# Altium schematic sheet POWER.SchDoc (part 2 of 3)
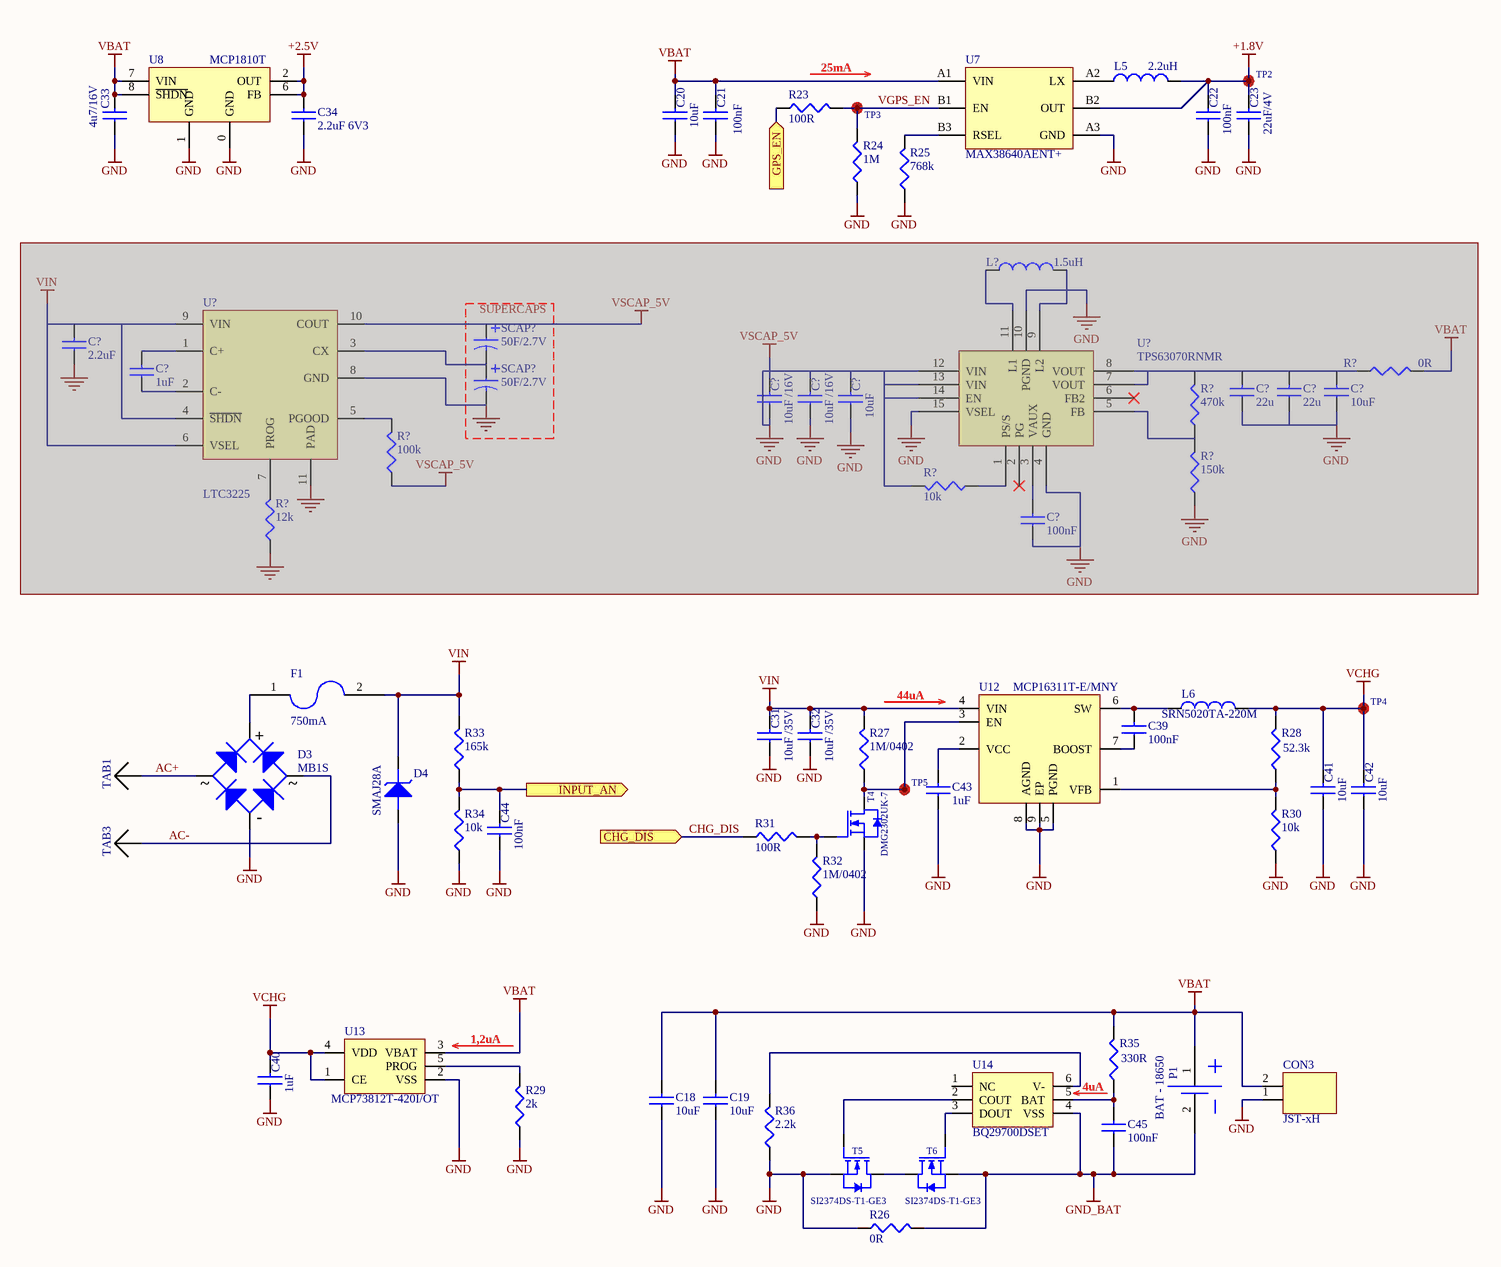
[diagram p1: POWER.SchDoc]
## Library data of the parts
C18-C20 C41 C42 = C - 10uF/10V: Cap Ceramic 10uF 10V X5R 10% SMD 0603 85C Paper T/R; Manufacturer: Samsung; Manufacturer Part Number: CL10A106KP8NNNC; IRNAS Part No.: /; Stock 1: 2844657; Pricing 1: 1=0.36, 10=0.248, 100=0.1403, 500=0.099, 1000=0.08663 (USD); Mount: Surface Mount; Case/Package: 0603; Case Code (Metric): 1608; Case Code (Imperial): 0603; Material: Ceramic; Contact Plating: Tin; Min Operating Temperature: -55°C; Max Operating Temperature: 85°C; Capacitance: 10uF; Tolerance: 10%; Package Quantity: 1; Packaging: Tape and Reel; Voltage Rating: 10V; Dielectric: X5R; Voltage Rating (DC): 10V; Length: 1.6mm; Height: 0.8mm; Width: 0.031inch; Thickness: 0.035inch; Depth: 0.8mm; Radiation Hardening: No; Lead Free: Lead Free; ComponentLink1URL: https://www.verical.com/server-webapp/html/getDatasheet?partID=359551; ComponentLink1Description: https://www.verical.com/server-webapp/html/getDatasheet?partID=359551; ComponentLink2URL: http://www1.futureelectronics.com/doc/SAMSUNG%20PASSIVE/CL05B104KQ5NNNC.pdf; ComponentLink2Description: http://www1.futureelectronics.com/doc/SAMSUNG%20PASSIVE/CL05B104KQ5NNNC.pdf; ComponentLink3URL: https://produktinfo.conrad.com/datenblaetter/450000-474999/457369-da-01-en-VS_KONDENSATOR_0603.pdf; ComponentLink3Description: https://produktinfo.conrad.com/datenblaetter/450000-474999/457369-da-01-en-VS_KONDENSATOR_0603.pdf
  C18 C19 C41 C42: Supplier 1: Digi-Key; Supplier Part Number 1: 1276-1192-1-ND
  C20: Supplier 1: Farnell; Supplier Part Number 1: 2456110
C21 C22 C39 C44 C45 = C - 100nF/0402: 0.1 F, 16 V,  5%, X5R, MC Series; Manufacturer: Multicomp; Manufacturer Part Number: MC0402X104J160CT; IRNAS Part No.: /; Voltage Rating: 16V; Supplier 1: Farnell; Stock 1: 3230; Pricing 1: 10=0.0139, 100=0.0108, 500=0.0076, 2500=0.0051, 5000=0.0038 (EUR); Case Code (Metric): 1005; Case Code (Imperial): 0402; Min Operating Temperature: -55°C; Max Operating Temperature: 85°C; Capacitance: 100nF; Dielectric: X5R; Packaging: Tape and Reel; Tolerance: 5%; Voltage Rating (DC): 16V; REACH SVHC: No SVHC; ComponentLink1URL: http://www.farnell.com/datasheets/2117933.pdf; ComponentLink1Description: http://www.farnell.com/datasheets/2117933.pdf; ComponentLink2URL: http://www.farnell.com/datasheets/2117900.pdf; ComponentLink2Description: http://www.farnell.com/datasheets/2117900.pdf; Supplier Part Number 1: 2627419
C23 = C - 10uF/10V: 22 µF, 4 V, 0603 [1608 Metric], ± 20%, X5R, GRM Series; Manufacturer: Samsung; Manufacturer Part Number: GRM188R60G226MEA0D; IRNAS Part No.: /; Material: Ceramic; Capacitance: 10uF; Tolerance: 10%; Voltage Rating: 10V; Stock 1: 2844657; Pricing 1: 1=0.36, 10=0.248, 100=0.1403, 500=0.099, 1000=0.08663 (USD); Mount: Surface Mount; Case/Package: 0603; Case Code (Metric): 1608; Case Code (Imperial): 0603; Contact Plating: Tin; Min Operating Temperature: -55°C; Max Operating Temperature: 85°C; Package Quantity: 1; Packaging: Tape and Reel; Dielectric: X5R; Voltage Rating (DC): 10V; Length: 1.6mm; Height: 0.8mm; Width: 0.031inch; Thickness: 0.035inch; Depth: 0.8mm; Radiation Hardening: No; Lead Free: Lead Free; ComponentLink1URL: https://www.verical.com/server-webapp/html/getDatasheet?partID=359551; ComponentLink1Description: https://www.verical.com/server-webapp/html/getDatasheet?partID=359551; ComponentLink2URL: http://www1.futureelectronics.com/doc/SAMSUNG%20PASSIVE/CL05B104KQ5NNNC.pdf; ComponentLink2Description: http://www1.futureelectronics.com/doc/SAMSUNG%20PASSIVE/CL05B104KQ5NNNC.pdf; ComponentLink3URL: https://produktinfo.conrad.com/datenblaetter/450000-474999/457369-da-01-en-VS_KONDENSATOR_0603.pdf; ComponentLink3Description: https://produktinfo.conrad.com/datenblaetter/450000-474999/457369-da-01-en-VS_KONDENSATOR_0603.pdf; Supplier 1: Farnell; Supplier Part Number 1: 1907502
C31 C32 = C - 10uF /16V: 10UF, 16V, 0805; Manufacturer: TDK; Manufacturer Part Number: CGA4J1X5R1C106K125AC; IRNAS Part No.: I-200007; RoHS: YES; Stock 1: 8974; Pricing 1: 5=0.41, 50=0.146, 250=0.131, 500=0.12, 1000=0.103 (GBP); ComponentLink1URL: http://bcove.me/e1v54mtm; ComponentLink1Description: http://bcove.me/e1v54mtm; ComponentLink2URL: http://www.farnell.com/datasheets/1936565.pdf; ComponentLink2Description: http://www.farnell.com/datasheets/1936565.pdf; ComponentLink3URL: http://www.farnell.com/datasheets/1683658.pdf; ComponentLink3Description: http://www.farnell.com/datasheets/1683658.pdf; Capacitance: 10uF; Case/Package: 0805; Case Code (Imperial): 0805; Supplier 1: Farnell; Supplier Part Number 1: 2611943
C33 = C - 4u7  16V 0603: 4.7UF, 16V, 0603; Manufacturer: MURATA; Manufacturer Part Number: GRM188R61C475KAAJD; IRNAS Part No.: I-200001; Ceramic Capacitor Case: 0603 [1608 Metric]; Capacitance: 4.7; Voltage Rating: 16; Capacitance Tolerance: ± 10%; Dielectric Characteristic: X5; Product Range: GRM Series; SVHC: No SVHC (17-Dec-2015)<!--FANDB--><div class="features-and-benefits-container"><div class="features-and-benefits-desc-container"><span class="features-and-benefits-container-desc">SMD Multilayer Ceramic Capacitor, 0603 [1608 Metric], 4.7 µF, 16 V, ± 10%, X5; Supplier 1: Farnell; RoHS: YES; Stock 1: 5038; Pricing 1: 10=0.16, 100=0.0929, 500=0.076, 1000=0.0618, 2000=0.0605, 4000=0.0425, 20000=0.0409, 40000=0.0355 (GBP); Packaging: Cut Tape; Operating Temperature Min: -55; Operating Temperature Max: 85; Automotive Qualification Standard: -; MSL: MSL 1 - Unlimited; ComponentLink1URL: http://www.farnell.com/datasheets/2079168.pdf; ComponentLink1Description: http://www.farnell.com/datasheets/2079168.pdf; Supplier Part Number 1: 2611924
C34 = C - 2.2uF/6V3/0402: CAP CER 2.2UF 6.3V 20% X5R 0402; Manufacturer: Murata; Manufacturer Part Number: GRM155R60J225ME15D; IRNAS Part No.: /; Material: Ceramic; Supplier 1: Farnell; Stock 1: 0; Pricing 1: 10=0.118, 100=0.0494, 500=0.031, 2500=0.0213, 5000=0.0163 (EUR); Mount: Surface Mount; Case/Package: 0402; Case Code (Metric): 1005; Case Code (Imperial): 0402; Min Operating Temperature: -55°C; Max Operating Temperature: 85°C; Packaging: Tape and Reel; Capacitance: 2.2uF; Tolerance: 20%; Package Quantity: 10000; Voltage Rating: 6.3V; Voltage Rating (DC): 6.3V; Dielectric: X5R; Termination: SMD/SMT; Voltage: 6.3V; Length: 1mm; Height: 0.5mm; Width: 0.02inch; Thickness: 0.022inch; Depth: 0.5mm; Radiation Hardening: No; REACH SVHC: No SVHC; Lead Free: Lead Free; ComponentLink1URL: https://datasheet.ciiva.com/29149/450128-da-01-de-vs-kondens-grm155-r60j-225me15d-29149006.pdf; ComponentLink1Description: https://datasheet.ciiva.com/29149/450128-da-01-de-vs-kondens-grm155-r60j-225me15d-29149006.pdf; ComponentLink2URL: https://datasheet.ciiva.com/46418/1754686-46418042.pdf; ComponentLink2Description: https://datasheet.ciiva.com/46418/1754686-46418042.pdf; ComponentLink3URL: https://datasheet.ciiva.com/17454/c02e-17454956.pdf; ComponentLink3Description: https://datasheet.ciiva.com/17454/c02e-17454956.pdf; ComponentLink4URL: https://datasheet.ciiva.com/235/partnumbering-e-01-235009.pdf; ComponentLink4Description: https://datasheet.ciiva.com/235/partnumbering-e-01-235009.pdf; ComponentLink5URL: https://datasheet.ciiva.com/2989/c02e-2989361.pdf; ComponentLink5Description: https://datasheet.ciiva.com/2989/c02e-2989361.pdf; ComponentLink6URL: https://datasheet.ciiva.com/235/partnumbering-e-01-235010.pdf; ComponentLink6Description: https://datasheet.ciiva.com/235/partnumbering-e-01-235010.pdf; ComponentLink7URL: https://datasheet.ciiva.com/235/partnumbering-e-01-235011.pdf; ComponentLink7Description: https://datasheet.ciiva.com/235/partnumbering-e-01-235011.pdf; Supplier Part Number 1: 2362088
C40 C43 = C - 1uF/0402: CAP CER 1UF 10V 20% X5R 0402; Manufacturer: Murata; Manufacturer Part Number: GRM155R61A105ME15D; IRNAS Part No.: /; Supplier 1: Farnell; Stock 1: 0; Pricing 1: 10=0.0379, 100=0.0266, 500=0.0156, 2500=0.0098, 5000=0.0083 (EUR); Mount: Surface Mount; Case/Package: 0402; Case Code (Metric): 1005; Case Code (Imperial): 0402; Min Operating Temperature: -55°C; Max Operating Temperature: 85°C; Capacitance: 1uF; Tolerance: 20%; Voltage Rating: 10V; Packaging: Tape and Reel; Package Quantity: 1; Dielectric: X5R; Voltage: 10V; Voltage Rating (DC): 10V; Length: 1mm; Height: 0.5mm; Width: 0.02inch; Thickness: 0.022inch; Depth: 0.5mm; Radiation Hardening: No; REACH SVHC: No SVHC; Lead Free: Lead Free; ComponentLink1URL: https://datasheet.ciiva.com/164/product-164665.pdf; ComponentLink1Description: https://datasheet.ciiva.com/164/product-164665.pdf; ComponentLink2URL: https://datasheet.ciiva.com/11616/product-11616508.pdf; ComponentLink2Description: https://datasheet.ciiva.com/11616/product-11616508.pdf; ComponentLink3URL: https://datasheet.ciiva.com/46418/1769893-46418047.pdf; ComponentLink3Description: https://datasheet.ciiva.com/46418/1769893-46418047.pdf; ComponentLink4URL: https://datasheet.ciiva.com/164/partnumbering-e-01-164666.pdf; ComponentLink4Description: https://datasheet.ciiva.com/164/partnumbering-e-01-164666.pdf; ComponentLink5URL: https://datasheet.ciiva.com/164/partnumbering-e-01-164667.pdf; ComponentLink5Description: https://datasheet.ciiva.com/164/partnumbering-e-01-164667.pdf; Supplier Part Number 1: 2426953
C?#1 = 2.2uF/0805: Multilayer Ceramic Capacitors MLCC - SMD/SMT 2.2uF 25V X7R 10%; Manufacturer: Yageo; Manufacturer Part Number: CC0805KKX7R8BB225; Supplier 1: Farnell; Stock 1: 0; Pricing 1: 5=0.269, 50=0.163, 250=0.109, 500=0.0929, 1500=0.0722, 3000=0.0594, 15000=0.05 (GBP); Mount: Surface Mount; Case/Package: 0805; Number of Pins: 2; Case Code (Imperial): 0805; Case Code (Metric): 2012; Min Operating Temperature: -55°C; Max Operating Temperature: 125°C; Packaging: Tape and Reel; Voltage Rating: 25V; Voltage Rating (DC): 25V; Tolerance: 10%; Capacitance: 2.2uF; Dielectric: X7R; Termination: SMD/SMT; Composition: Ceramic; Length: 2mm; Height: 0.3mm; Depth: 1.25mm; Width: 1.25mm; Thickness: 0.057inch; Radiation Hardening: No; REACH SVHC: Unknown; Lead Free: Lead Free; Halogen Free: Halogen Free; ComponentLink1URL: https://datasheet.ciiva.com/7009/775840-7009706.pdf; ComponentLink1Description: https://datasheet.ciiva.com/7009/775840-7009706.pdf; Supplier Part Number 1: 1458904
C?#2 = 1uF: MURATA - GRM188R61H105KAALD - CAP, MLCC, X5R, 1UF, 50V, 0603; Ceramic Capacitor Case: 0603 [1608 Metric]; Capacitance: 1; Voltage Rating: 50; Capacitance Tolerance: ± 10%; Dielectric Characteristic: X5; Product Range: GRM Series; SVHC: No SVHC (17-Dec-2015); Capacitor Terminals: SMD<!--FANDB--><div class="features-and-benefits-container"><div class="features-and-benefits-description"><span class="features-benefits-value">The Murata GRM series capacitors are Multilayer Ceramic Chip Capacitors (MLCC) used for general purpose applications. These MLCC capacitors are classified into temperature compensating and high dielectric constant types depending on the change in electrostatic capacitance due to change in temperature. The temperature compensating capacitors feature a small rate of change in electrostatic capacitance as the temperature changes and are used for applications such as filters and high frequency circuit matching. The high dielectric constant capacitors use materials with a high dielectric constant and feature a large electrostatic capacitance. Typical applications are power supply decoupling and smoothing circuits.</span></div><div class="features-and-benefits-list"><ul class="features-and-benefits-list-list"><li class="features-and-benefits-list-item">Large capacity and small size in a multilayer structure</li><li class="features-and-benefits-list-item">Capacitance value ranging from 0.1pF to 220?F</li><li class="features-and-benefits-list-item">Tin plated external electrodes, excellent solderability</li><li class="features-and-benefits-list-item">Provides good high frequency characteristics</li><li class="features-and-benefits-list-item">Excellent pulse response</li><li class="features-and-benefits-list-item">High reliability</li><li class="features-and-benefits-list-item">Capacitor size varies from 0.4×0.2mm to 5.7×5.0mm</li><li class="features-and-benefits-list-item">Rated voltage of 2.5VDC to 3.15; Supplier 1: Farnell; Manufacturer: MURATA; Manufacturer Part Number: GRM188R61H105KAALD; RoHS: YES; Stock 1: 62682; Pricing 1: 10=0.093, 100=0.062, 500=0.0507, 1000=0.0465, 2000=0.0429, 4000=0.0399, 20000=0.0372, 40000=0.0365 (GBP); Packaging: Cut Tape; Operating Temperature Min: -55; Operating Temperature Max: 85; Automotive Qualification Standard: -; MSL: -; Capacitance Tolerance ±: ± 10%; ComponentLink1URL: http://www.farnell.com/datasheets/2048611.pdf; ComponentLink1Description: http://www.farnell.com/datasheets/2048611.pdf; Supplier Part Number 1: 1845736
C?#3 C?#4 = 10uF /16V: TDK - CGA4J1X5R1C106K125AC - CAP, MLCC, X5R, 10UF, 16V, 0805; Supplier 1: Farnell; Manufacturer: TDK; Manufacturer Part Number: CGA4J1X5R1C106K125AC; RoHS: YES; Stock 1: 8974; Pricing 1: 5=0.41, 50=0.146, 250=0.131, 500=0.12, 1000=0.103 (GBP); ComponentLink1URL: http://bcove.me/e1v54mtm; ComponentLink1Description: http://bcove.me/e1v54mtm; ComponentLink2URL: http://www.farnell.com/datasheets/1936565.pdf; ComponentLink2Description: http://www.farnell.com/datasheets/1936565.pdf; ComponentLink3URL: http://www.farnell.com/datasheets/1683658.pdf; ComponentLink3Description: http://www.farnell.com/datasheets/1683658.pdf; Supplier Part Number 1: 2210948RL
C?#5 C?#6 = 22u 6.3V 0805: MULTICOMP - MC0805X226M6R3CT - CAP, MLCC, X5R, 22UF, 0805; Ceramic Capacitor Case: 0805 [2012 Metric]; Capacitance: 22; Voltage Rating: 6.3; Capacitance Tolerance: ± 20%; Dielectric Characteristic: X5; Product Range: MC Series; SVHC: No SVHC (07-Jul-2017); Capacitor Terminals: SMD; Supplier 1: Farnell; Manufacturer: MULTICOMP; Manufacturer Part Number: MC0805X226M6R3CT; RoHS: YES; Stock 1: 74736; Pricing 1: 5=0.128, 50=0.0738, 250=0.0507, 500=0.042, 1500=0.0358 (GBP); Packaging: Cut Tape; Operating Temperature Min: -55; Operating Temperature Max: 85; Automotive Qualification Standard: -; MSL: -; Capacitance Tolerance ±: ± 20%; Operating Temperature Range: -55°C to +85°C<!--FANDB--><div class="features-and-benefits-container"><div class="features-and-benefits-desc-container"><span class="features-and-benefits-container-desc">SMD Multilayer Ceramic Capacitor, 0805 [2012 Metric], 22 µF, 6.3 V, ± 20%, X5R, MC Series</span></div><div class="features-and-benefits-description"><span class="features-benefits-value">The Multicomp MC series is general purpose MLCC capacitors with X5R dielectric material which provides high electrical precision, stability and reliability. This MLCC capacitor consists of a conducting material and electrodes with high density and high efficiency ceramic condensers.</span></div><div class="features-and-benefits-list"><ul class="features-and-benefits-list-list"><li class="features-and-benefits-list-item">Small size with higher capacitance values</li><li class="features-and-benefits-list-item">0201, 0402, 0603, 0805, 1206, 1210, 1812 case sizes available</li><li class="features-and-benefits-list-item">Capacitance value ranging from 100pF to 220?F</li><li class="features-and-benefits-list-item">Capacitor with lead free termination (pure Tin)</li><li class="features-and-benefits-list-item">High electrical precision, stability and reliability</li><li class="features-and-benefits-list-item">Rated voltage of 4V, 6.3V, 10V, 16V, 25V, 50V</li><li class="features-and-benefits-list-item">Operating temperature of -55°C to +85°C</li><li class="features-and-benefits-list-item">Available in ±10% and ±20; ComponentLink1URL: http://www.farnell.com/datasheets/1901289.pdf; ComponentLink1Description: http://www.farnell.com/datasheets/1901289.pdf; ComponentLink2URL: http://www.farnell.com/datasheets/1932399.pdf; ComponentLink2Description: http://www.farnell.com/datasheets/1932399.pdf; Supplier Part Number 1: 1759415
C?#7 C?#8 = 10uF/10V: Cap Ceramic 10uF 10V X5R 10% SMD 0603 85C Paper T/R; Manufacturer: Samsung; Manufacturer Part Number: CL10A106KP8NNNC; Supplier 1: Digi-Key; Stock 1: 2844657; Pricing 1: 1=0.36, 10=0.248, 100=0.1403, 500=0.099, 1000=0.08663 (USD); Mount: Surface Mount; Case/Package: 0603; Case Code (Metric): 1608; Case Code (Imperial): 0603; Material: Ceramic; Contact Plating: Tin; Min Operating Temperature: -55°C; Max Operating Temperature: 85°C; Capacitance: 10uF; Tolerance: 10%; Package Quantity: 1; Packaging: Tape and Reel; Voltage Rating: 10V; Dielectric: X5R; Voltage Rating (DC): 10V; Length: 1.6mm; Height: 0.8mm; Width: 0.031inch; Thickness: 0.035inch; Depth: 0.8mm; Radiation Hardening: No; Lead Free: Lead Free; ComponentLink1URL: https://www.verical.com/server-webapp/html/getDatasheet?partID=359551; ComponentLink1Description: https://www.verical.com/server-webapp/html/getDatasheet?partID=359551; ComponentLink2URL: http://www1.futureelectronics.com/doc/SAMSUNG%20PASSIVE/CL05B104KQ5NNNC.pdf; ComponentLink2Description: http://www1.futureelectronics.com/doc/SAMSUNG%20PASSIVE/CL05B104KQ5NNNC.pdf; ComponentLink3URL: https://produktinfo.conrad.com/datenblaetter/450000-474999/457369-da-01-en-VS_KONDENSATOR_0603.pdf; ComponentLink3Description: https://produktinfo.conrad.com/datenblaetter/450000-474999/457369-da-01-en-VS_KONDENSATOR_0603.pdf; Supplier Part Number 1: 1276-1192-1-ND
C?#9 = 100nF: MURATA - GRM188R71C104KA01J - CAP, MLCC, X7R, 0.1UF, 16V, 0603; Ceramic Capacitor Case: 0603 [1608 Metric]; Capacitance: 0.1; Voltage Rating: 16; Capacitance Tolerance: ± 10%; Dielectric Characteristic: X7; Product Range: GRM Series; SVHC: No SVHC (20-Jun-2016; Supplier 1: Farnell; Manufacturer: MURATA; Manufacturer Part Number: GRM188R71C104KA01J; RoHS: YES; Stock 1: 18297; Pricing 1: 10=0.0145, 100=0.0126, 500=0.0081, 2500=0.0059, 5000=0.0052, 10000=0.0046, 50000=0.0036, 100000=0.0035 (GBP); Packaging: Cut Tape; Operating Temperature Min: -55; Operating Temperature Max: 125; Automotive Qualification Standard: -; MSL: MSL 1 - Unlimited; ComponentLink1URL: http://www.farnell.com/datasheets/2189124.pdf; ComponentLink1Description: http://www.farnell.com/datasheets/2189124.pdf; Supplier Part Number 1: 2688519
CON3 = B2B-XH-A (LF)(SN): Wire-To-Board Connector, Vertical, 2.5 mm, 2 Contacts, Header, XH Series, Through Hole, 1 Rows; ComponentLink1Description: Datasheet; ComponentLink1URL: http://www.farnell.com/datasheets/2057209.pdf?_ga=2.26100990.2144023421.1568612611-1741076818.1563951383; Supplier 1: Farnell; Supplier Part Number 1: 1516276
D3 = D_GREZ - MB1S: Bridge Rectifier Diode, Single Phase, 100 V, 500 mA, SOIC, 1 V, 4 Pins; Manufacturer: DIODES INC.; Manufacturer Part Number: 1N4148W-7-F.; Repetitive Reverse Voltage Vrrm Max: 100; Forward Current If(AV): 300; Forward Voltage VF Max: 1.25; Reverse Recovery Time trr Max: 4; Forward Surge Current Ifsm Max: 2; Diode Case Style: SOD-123; Product Range: 1N4148 Series; SVHC: No SVHC (17-Dec-2015); Diode Type: Switching; RoHS: YES; Stock 1: 157320; Pricing 1: 1=0.136, 25=0.132, 100=0.0465, 500=0.042, 1000=0.024, 3000=0.021, 9000=0.017, 30000=0.0149 (GBP); Diode Configuration: Single; Operating Temperature Max: 150; No. of Pins: 2; Packaging: Cut Tape; Automotive Qualification Standard: -; MSL: MSL 1 - Unlimited; Operating Temperature Min: -65; Operating Temperature Range: -65°C to +150°C<!--FANDB--><div class="features-and-benefits-container"><div class="features-and-benefits-description"><span class="features-benefits-value">The 1N4148W-7-F is a surface mount fast Switching Diode with moulded plastic case. Suitable for general purpose switching applications.</span></div><div class="features-and-benefits-list"><ul class="features-and-benefits-list-list"><li class="features-and-benefits-list-item">Fast Switching Speed</li><li class="features-and-benefits-list-item">2; ComponentLink1URL: http://www.farnell.com/datasheets/2304089.pdf?_ga=2.145303924.1501170171.1569221802-1373726713.1554121096&_gac=1.216412644.1567774175.Cj0KCQjwh8jrBRDQARIsAH7BsXewc7Dwr4vpljjl78IYTw8YgbCKKX8PqbiwpEZSRALCWSJq0A6KVZoaAvm4EALw_wcB; ComponentLink1Description: Datasheet; Supplier 1: Farnell; Supplier Part Number 1: 1467483
D4 = D_TVS - SMAJ28A: TVS Diode, SMAJ Series, Unidirectional, 28 V, 50 V, DO-214AC, 2 Pins; Manufacturer Part Number: SMAJ33A-13-F; ComponentLink1Description: Datasheet; ComponentLink1URL: http://www.farnell.com/datasheets/2182694.pdf?_ga=2.17570096.807337928.1565251792-1741076818.1563951383; Supplier 1: Farnell; Supplier Part Number 1: 3127459
F1 = F - PTC FUSE 750mA: LITTELFUSE - 0603L035YR - RESETTABLE FUSE, PTC, 40A, 6V, 0605; IRNAS Part No.: /; Thermistor Mounting: SMD; Holding Current: 350; Tripping Current: 750; Voltage Rating: 6; Carrying Current Max: 40; Initial Resistance Max: 1; PTC Fuse Case Style: 0603 [1608 Metric]; Power Dissipation Pd: 0.5W<!--FANDB--><div class="features-and-benefits-container"><div class="features-and-benefits-description"><span class="features-benefits-value">The POLYFUSE 0603; Manufacturer: LITTELFUSE; Manufacturer Part Number: 0603L035YR; RoHS: YES; Stock 1: 2393; Pricing 1: 10=1.56, 100=1.22, 500=1.03, 1000=0.917, 2000=0.877, 4000=0.86, 20000=0.842, 40000=0.825 (GBP); Product Range: POLYFUSE 0603; Operating Temperature Min: -40; Operating Temperature Max: 85; Automotive Qualification Standard: -; Holding Current Max Ih: 350; Operating Voltage: 6; ComponentLink1URL: http://www.farnell.com/datasheets/611622.pdf; ComponentLink1Description: http://www.farnell.com/datasheets/611622.pdf; Supplier 1: Farnell; Supplier Part Number 1: 2786561
L5 = L - 2.2 uH 900mA: Power Inductor (SMD), 2.2 µH, 900 mA, Semishielded, 900 mA, SRN2009T Series, 2mm x 1.6mm x 0.95mm; Manufacturer: Bourns; Manufacturer Part Number: SRN2009T-2R2M; IRNAS Part No.: /; Supplier 1: Farnell; Stock 1: 1975; Pricing 1: 5=0.308, 50=0.201, 250=0.163, 500=0.145, 1000=0.133, 2000=0.124, 10000=0.116 (EUR); Supplier Part Number 1: 2808272
L6 = L - 22uH 1.1A SRN5020TA-220M: Power Inductor (SMD), 22 µH, 1.1 A, Semishielded, 1.1 A, SRN5020TA Series, 5mm x 5mm x 1.8mm; Manufacturer: COILTRONICS; Manufacturer Part Number: DR125-330-R; IRNAS Part No.: /; Product Range: DR Series; Inductance: 33; RMS Current (Irms): 3.28; Saturation Current (Isat): 3.84; Power Inductor Case: 12.5mm x 12.5mm x 6; Inductance Tolerance: ± 20%; SVHC: No SVHC (15-Jun-2015); No. of Pins: 2Pins<!--FANDB--><div class="features-and-benefits-container"><div class="features-and-benefits-description"><span class="features-benefits-value">The DR125-330-R is a 33; RoHS: YES; Stock 1: 5001; Pricing 1: 1=1.53, 10=1.02, 50=0.765, 100=0.68, 200=0.612, 600=0.51, 3000=0.456, 6000=0.447 (GBP); Inductor Construction: Shielded; DC Resistance Max: -; Packaging: Cut Tape; ComponentLink1URL: http://www.farnell.com/datasheets/2675146.pdf?_ga=2.250340422.1501170171.1569221802-1373726713.1554121096&_gac=1.157768008.1567774175.Cj0KCQjwh8jrBRDQARIsAH7BsXewc7Dwr4vpljjl78IYTw8YgbCKKX8PqbiwpEZSRALCWSJq0A6KVZoaAvm4EALw_wcB; ComponentLink1Description: Datasheet; Supplier 1: Mouser; Supplier Part Number 1: 652-SRN5020TA-220M
L? = 1.5uH 5.1A: MURATA - FDSD0420-H-1R5M=P3 - INDUCTOR, SHIELDED, 1.5UH, 5.1A, 20%; Product Range: FDSD0420 Series; Inductance: 1.5; RMS Current (Irms): 5.1; Saturation Current (Isat): 7.7; DC Resistance Max: 0.036; Power Inductor Case: 4.2mm x 4.2mm x 2; SVHC: No SVHC (17-Dec-2015); Supplier 1: Farnell; Manufacturer: MURATA; Manufacturer Part Number: FDSD0420-H-1R5M=P3; RoHS: YES; Stock 1: 1471; Pricing 1: 5=0.79, 50=0.448, 250=0.422, 500=0.377, 1000=0.305, 2000=0.298, 10000=0.291, 20000=0.284 (GBP); Inductor Construction: Shielded; Inductance Tolerance: ± 20%; Packaging: Each; MSL: MSL 1 - Unlimited<!--FANDB--><div class="features-and-benefits-container"></div>; ComponentLink1URL: http://www.farnell.com/datasheets/2021980.pdf; ComponentLink1Description: http://www.farnell.com/datasheets/2021980.pdf; Supplier Part Number 1: 2530091
P1 = BAT - 18650: BATERRY 18650; Manufacturer Part Number: 18650; Manufacturer 1: Samsung; Supplier 1: IRNAS
R23 R31 = R - 100R/0402: 100 ohm, 50 V, 0402 [1005 Metric], 62.5 mW,  1%; Manufacturer: Multicomp; Manufacturer Part Number: MCMR04X1000FTL; IRNAS Part No.: /; Temperature Coefficient: 100ppm/°C; Power Rating: 62.5mW; Voltage Rating: 50V; Supplier 1: Farnell; Stock 1: 62365; Pricing 1: 10=0.0071, 100=0.0042, 500=0.003, 2500=0.0024, 5000=0.0019 (GBP); Case/Package: 0402; Case Code (Metric): 1005; Case Code (Imperial): 0402; Resistance: 100R; Tolerance: 1%; Composition: Ceramic; Packaging: Cut Tape; Voltage Rating (DC): 50V; REACH SVHC: No SVHC; ComponentLink1URL: https://datasheet.ciiva.com/28692/1716705-28692087.pdf; ComponentLink1Description: https://datasheet.ciiva.com/28692/1716705-28692087.pdf; ComponentLink2URL: https://datasheet.ciiva.com/22708/1716705-22708156.pdf; ComponentLink2Description: https://datasheet.ciiva.com/22708/1716705-22708156.pdf; Supplier Part Number 1: 2072515
R24 R27 R32 = R - 1M/0402: MCMR04X1004FTL RES, 1M, 1%, 0.0625W, 0402, THICK FILM; Manufacturer: MULTICOMP; Manufacturer Part Number: MC0063W060311M; IRNAS Part No.: I-100012; Resistance: 1; Voltage Rating: 50; Resistor Case Style: 0603 [1608 Metric]; Power Rating: 63; Product Range: MC Series; Temperature Coefficient: ± 100; SVHC: No SVHC (17-Dec-2015); External Depth: 0.45; External Length / Height: 1.6; External Width: 0.8; No. of Pins: 2; Reel Quantity: 5000; Resistor Mounting: Surface Mount Device; Temperature Coeff. +: 100; Voltage Rating V DC: 50V<!--FANDB--><div class="features-and-benefits-container"><div class="features-and-benefits-description"><span class="features-benefits-value">The Multicomp MC series current sense resistors are thick film chip resistors. The resistance range includes E96 and E24 decade values from 1ohm to 10Mohm.</span></div><div class="features-and-benefits-list"><ul class="features-and-benefits-list-list"><li class="features-and-benefits-list-item">EIA 0402, 0603, 0805, 1206 chip sizes available</li><li class="features-and-benefits-list-item">Small size and low weight</li><li class="features-and-benefits-list-item">Suitable for both wave and reflow soldering</li><li class="features-and-benefits-list-item">Reduction of assembly costs</li><li class="features-and-benefits-list-item">Maximum working voltage of 50V(0402, 0603), 150V(0805), 200V(1206)</li><li class="features-and-benefits-list-item">Available in ±1%, ±2% and ±5% tolerance</li><li class="features-and-benefits-list-item">Power rating of 62.5mW, 100mW and 125mW</li><li class="features-and-benefits-list-item">±400ppm/°C(1ohm to 10ohm), ±200ppm/°C(11ohm to 100ohm), ±100; Supplier 1: Farnell; RoHS: Y-EX; Stock 1: 333415; Pricing 1: 10=0.0011, 100=0.001, 500=0.0009, 1000=0.0008, 2500=0.0007 (GBP); Resistance Tolerance: ± 1%; Packaging: Cut Tape; Resistor Element Material: Thick Film; Automotive Qualification Standard: -; Operating Temperature Max: 155; Operating Temperature Min: -55; Operating Temperature Range: -55°C to +155; Tape Width: 8; Temperature Coeff. -: 100; Tolerance +: 1%; Tolerance -: 1%; ComponentLink1URL: http://www.farnell.com/datasheets/1788326.pdf; ComponentLink1Description: http://www.farnell.com/datasheets/1788326.pdf; ComponentLink2URL: http://www.farnell.com/cad/1558928.zip; ComponentLink2Description: http://www.farnell.com/cad/1558928.zip; Supplier Part Number 1: 9330410
R25 = R - 768k/0402: RESISTOR, 0402, 768k, ANTI SULFURATION; Manufacturer: Multicomp; Manufacturer Part Number: MCMR04X000PTL; IRNAS Part No.: I-100016; Voltage Rating: 50V; Resistance: 0mR; Power Rating: 62.5mW; Temperature Coefficient: 400ppm/°C; Stock 1: 0; Pricing 1: 10=0.0057, 100=0.0034, 500=0.0024, 2500=0.0019, 5000=0.0015 (EUR); Case/Package: 0402; Case Code (Metric): 1005; Case Code (Imperial): 0402; Packaging: Cut Tape; Composition: Ceramic; Voltage Rating (DC): 50V; REACH SVHC: No SVHC; Supplier 1: Farnell; Supplier Part Number 1: 2670555
R26 = R - 0R: BOURNS - CR0603-J/-000ELF - RES, THICK FILM, 0R, 5%, 0.1W, 0603; IRNAS Part No.: I-100011; Resistance: 0; Voltage Rating: 50; Resistor Case Style: 0603 [1608 Metric]; Power Rating: 100; Product Range: CR Series; SVHC: No SVHC (17-Dec-2015); Resistor Mounting: Surface Mount Device<!--FANDB--><div class="features-and-benefits-container"><div class="features-and-benefits-description"><span class="features-benefits-value">The Bourns CR series are standard thick film chip resistors. These resistors provide flexibility of performance, space saving and low cost. The Resistance range includes E96 and E24 decade values from 1ohm to 10Mohm.</span></div><div class="features-and-benefits-list"><ul class="features-and-benefits-list-list"><li class="features-and-benefits-list-item">0201, 0402, 0603, 0805, 1206, 1210, 2010, 2512 standard case sizes available</li><li class="features-and-benefits-list-item">±1% and ±5% tolerance</li><li class="features-and-benefits-list-item">±100ppm/°C, ±200ppm/°C and ±250ppm/°C TCR values available</li><li class="features-and-benefits-list-item">Power rating selectable for 50mW, 63mW, 0.1W, 0.125W, 0.25W, 0.5W and 1W based on ordering</li><li class="features-and-benefits-list-item">Jumpers are available for all size</li><li class="features-and-benefits-list-item">3 layer termination process with nickel barrier prevents leaching & provides excellent solderability</li><li class="features-and-benefits-list-item">Suitable for all type of soldering processes</li><li class="features-and-benefits-list-item">Tight dimensional tolerances</li><li class="features-and-benefits-list-item">Maximum working voltage depends on case size</li><li class="features-and-benefits-list-item">Operating temperature of -55°C to +125°C(CR0201) and -55°C to +155; Supplier 1: Farnell; Manufacturer: BOURNS; Manufacturer Part Number: CR0603-J/-000ELF; RoHS: YES; Stock 1: 58200; Pricing 1: 10=0.0146, 250=0.0097, 1000=0.0073, 5000=0.0049, 12500=0.0042 (GBP); Resistance Tolerance: ± 5%; Packaging: Cut Tape; Resistor Element Material: Thick Film; Temperature Coefficient: -; Automotive Qualification Standard: -; MSL: MSL 1 - Unlimited; ComponentLink1URL: http://www.bourns.com/engineering/CHPREZTR/cr0603.stp; ComponentLink1Description: http://www.bourns.com/engineering/CHPREZTR/cr0603.stp; ComponentLink2URL: http://www.farnell.com/datasheets/2178762.pdf; ComponentLink2Description: http://www.farnell.com/datasheets/2178762.pdf; Supplier Part Number 1: 2008343
R28 = R - 10k/0402: 52.3 kohm, 50 V, 0402 [1005 Metric], 62.5 mW,  1%, MCWR Series; Manufacturer: Multicomp; Manufacturer Part Number: MCWR04X1002FTL; Resistance: 10kR; Voltage Rating: 50V; Power Rating: 62.5mW; Temperature Coefficient: 100ppm/°C; Stock 1: 602609; Pricing 1: 10=0.0029, 100=0.0017, 500=0.0012, 2500=0.001, 5000=0.0008 (EUR); Case/Package: 0402; Case Code (Metric): 1005; Case Code (Imperial): 0402; Packaging: Cut Tape; Composition: Thick Film; Tolerance: 1%; Voltage Rating (DC): 50V; REACH SVHC: No SVHC; ComponentLink1URL: http://www.farnell.com/datasheets/1849611.pdf; ComponentLink1Description: http://www.farnell.com/datasheets/1849611.pdf; Supplier 1: Farnell; Supplier Part Number 1: 2073114
R29 = R - 2k/0402: 2 kohm, 62.5 mW,  1%, 50 V; Manufacturer: Multicomp; Manufacturer Part Number: MCWR04X2001FTL; IRNAS Part No.: /; Resistance: 2kR; Power Rating: 62.5mW; Voltage Rating: 50V; Temperature Coefficient: 100ppm/°C; Stock 1: 18534; Pricing 1: 10=0.0029, 100=0.0017, 500=0.0012, 2500=0.001, 5000=0.0008 (EUR); Mount: Surface Mount; Case/Package: 0402; Case Code (Metric): 1005; Case Code (Imperial): 0402; Tolerance: 1%; Packaging: Cut Tape; Composition: Thick Film; Voltage Rating (DC): 50V; REACH SVHC: No SVHC; ComponentLink1URL: https://datasheet.ciiva.com/46443/1849611-46443359.pdf; ComponentLink1Description: https://datasheet.ciiva.com/46443/1849611-46443359.pdf; Supplier 1: Farnell; Supplier Part Number 1: 2447147
R30 = R - 10k/0402: 10 kohm, 50 V, 0402 [1005 Metric], 62.5 mW,  1%, MCWR Series; Manufacturer: Multicomp; Manufacturer Part Number: MCWR04X1002FTL; IRNAS Part No.: I-100014; Resistance: 10kR; Voltage Rating: 50V; Power Rating: 62.5mW; Temperature Coefficient: 100ppm/°C; Supplier 1: Farnell; Stock 1: 602609; Pricing 1: 10=0.0029, 100=0.0017, 500=0.0012, 2500=0.001, 5000=0.0008 (EUR); Case/Package: 0402; Case Code (Metric): 1005; Case Code (Imperial): 0402; Packaging: Cut Tape; Composition: Thick Film; Tolerance: 1%; Voltage Rating (DC): 50V; REACH SVHC: No SVHC; ComponentLink1URL: http://www.farnell.com/datasheets/1849611.pdf; ComponentLink1Description: http://www.farnell.com/datasheets/1849611.pdf; Supplier Part Number 1: 2447096
R33 = R - 165k/0402: RES SMD 165K OHM 1% 1/16W 0402; Manufacturer: Vishay; Manufacturer Part Number: CRCW0402165KFKED; IRNAS Part No.: /; Resistance: 165kR; Power Rating: 63mW; Voltage Rating: 50V; Temperature Coefficient: 100ppm/°C; Stock 1: 5845; Pricing 1: 1=0.1, 10=0.044, 100=0.0178, 1000=0.00802, 2500=0.00696, 5000=0.00575 (USD); Case/Package: 0402; Number of Pins: 2; Weight: 2.3E-05oz; Case Code (Metric): 1005; Case Code (Imperial): 0402; Contact Plating: Tin; Min Operating Temperature: -55°C; Max Operating Temperature: 155°C; Package Quantity: 10; Tolerance: 1%; Packaging: Tape and Reel; Composition: Thick Film; Number of Terminations: 2; Termination: SMD/SMT; Military Standard: Not; Max Power Dissipation: 63mW; Length: 1mm; Height: 0.35mm; Width: 0.02inch; Depth: 0.5mm; REACH SVHC: Unknown; ComponentLink1URL: https://datasheet.ciiva.com/11817/0900766b80d98824-11817998.pdf; ComponentLink1Description: https://datasheet.ciiva.com/11817/0900766b80d98824-11817998.pdf; ComponentLink2URL: https://datasheet.ciiva.com/2463/dcrcwe3-2463568.pdf; ComponentLink2Description: https://datasheet.ciiva.com/2463/dcrcwe3-2463568.pdf; ComponentLink3URL: https://datasheet.ciiva.com/2463/dcrcwe3-2463569.pdf; ComponentLink3Description: https://datasheet.ciiva.com/2463/dcrcwe3-2463569.pdf; ComponentLink4URL: https://datasheet.ciiva.com/2463/dcrcwe3-2463570.pdf; ComponentLink4Description: https://datasheet.ciiva.com/2463/dcrcwe3-2463570.pdf; ComponentLink5URL: https://datasheet.ciiva.com/16202/dcrcwe3-16202613.pdf; ComponentLink5Description: https://datasheet.ciiva.com/16202/dcrcwe3-16202613.pdf; ComponentLink6URL: https://datasheet.ciiva.com/22705/1697337-22705813.pdf; ComponentLink6Description: https://datasheet.ciiva.com/22705/1697337-22705813.pdf; ComponentLink7URL: https://datasheet.ciiva.com/22676/1912744-22676022.pdf; ComponentLink7Description: https://datasheet.ciiva.com/22676/1912744-22676022.pdf; ComponentLink8URL: https://datasheet.ciiva.com/3256/dcrcwe3-3256088.pdf; ComponentLink8Description: https://datasheet.ciiva.com/3256/dcrcwe3-3256088.pdf; ComponentLink9URL: https://datasheet.ciiva.com/16760/70201119-16760089.pdf; ComponentLink9Description: https://datasheet.ciiva.com/16760/70201119-16760089.pdf; ComponentLink10URL: https://datasheet.ciiva.com/7714/1697337-7714174.pdf; ComponentLink10Description: https://datasheet.ciiva.com/7714/1697337-7714174.pdf; ComponentLink11URL: https://datasheet.ciiva.com/5545/dcrcwe3-109170-5545151.pdf; ComponentLink11Description: https://datasheet.ciiva.com/5545/dcrcwe3-109170-5545151.pdf; ComponentLink12URL: https://datasheet.ciiva.com/7714/1697337-7714175.pdf; ComponentLink12Description: https://datasheet.ciiva.com/7714/1697337-7714175.pdf; Supplier 1: Farnell; Supplier Part Number 1: 2072686
R34 = R - 10k/0402: 10 kohm, 50 V, 0402, 62.5 mW,  1%,; Manufacturer: Multicomp; Manufacturer Part Number: MCWR04X1002FTL; IRNAS Part No.: I-100014; Resistance: 10kR; Voltage Rating: 50V; Power Rating: 62.5mW; Temperature Coefficient: 100ppm/°C; Supplier 1: Farnell; Stock 1: 602609; Pricing 1: 10=0.0029, 100=0.0017, 500=0.0012, 2500=0.001, 5000=0.0008 (EUR); Case/Package: 0402; Case Code (Metric): 1005; Case Code (Imperial): 0402; Packaging: Cut Tape; Composition: Thick Film; Tolerance: 1%; Voltage Rating (DC): 50V; REACH SVHC: No SVHC; ComponentLink1URL: http://www.farnell.com/datasheets/1849611.pdf; ComponentLink1Description: http://www.farnell.com/datasheets/1849611.pdf; Supplier Part Number 1: 2447096
R35 = R - 330R/0402: 330 ohm, 62.5 mW,  1%, 50 V, 0402 [1005 Metric]; Manufacturer: Multicomp; Manufacturer Part Number: MCMR04X3300FTL; IRNAS Part No.: /; Power Rating: 62.5mW; Voltage Rating: 50V; Temperature Coefficient: 100ppm/°C; Supplier 1: Farnell; Stock 1: 20000; Pricing 1: 10000=0.0015, 50000=0.0013 (EUR); Case/Package: 0402; Case Code (Metric): 1005; Case Code (Imperial): 0402; Tolerance: 1%; Resistance: 330R; Packaging: Cut Tape; Composition: Ceramic; Voltage Rating (DC): 50V; REACH SVHC: No SVHC; ComponentLink1URL: https://datasheet.ciiva.com/28673/1716706-28673288.pdf; ComponentLink1Description: https://datasheet.ciiva.com/28673/1716706-28673288.pdf; Supplier Part Number 1: 2692084
R36 = R - 2k/0402: 2.2 kohm, 62.5 mW,  1%, 50 V; Manufacturer: Multicomp; Manufacturer Part Number: MCWR04X2001FTL; Resistance: 2k"R; Power Rating: 62.5mW; Voltage Rating: 50V; Temperature Coefficient: 100ppm/°C; Stock 1: 18534; Pricing 1: 10=0.0029, 100=0.0017, 500=0.0012, 2500=0.001, 5000=0.0008 (EUR); Mount: Surface Mount; Case/Package: 0402; Case Code (Metric): 1005; Case Code (Imperial): 0402; Tolerance: 1%; Packaging: Cut Tape; Composition: Thick Film; Voltage Rating (DC): 50V; REACH SVHC: No SVHC; ComponentLink1URL: https://datasheet.ciiva.com/46443/1849611-46443359.pdf; ComponentLink1Description: https://datasheet.ciiva.com/46443/1849611-46443359.pdf; Supplier 1: Farnell; Supplier Part Number 1: 2447148
R?#1 = 0R: BOURNS - CR0603-J/-000ELF - RES, THICK FILM, 0R, 5%, 0.1W, 0603; Resistance: 0; Voltage Rating: 50; Resistor Case Style: 0603 [1608 Metric]; Power Rating: 100; Product Range: CR Series; SVHC: No SVHC (17-Dec-2015); Resistor Mounting: Surface Mount Device<!--FANDB--><div class="features-and-benefits-container"><div class="features-and-benefits-description"><span class="features-benefits-value">The Bourns CR series are standard thick film chip resistors. These resistors provide flexibility of performance, space saving and low cost. The Resistance range includes E96 and E24 decade values from 1ohm to 10Mohm.</span></div><div class="features-and-benefits-list"><ul class="features-and-benefits-list-list"><li class="features-and-benefits-list-item">0201, 0402, 0603, 0805, 1206, 1210, 2010, 2512 standard case sizes available</li><li class="features-and-benefits-list-item">±1% and ±5% tolerance</li><li class="features-and-benefits-list-item">±100ppm/°C, ±200ppm/°C and ±250ppm/°C TCR values available</li><li class="features-and-benefits-list-item">Power rating selectable for 50mW, 63mW, 0.1W, 0.125W, 0.25W, 0.5W and 1W based on ordering</li><li class="features-and-benefits-list-item">Jumpers are available for all size</li><li class="features-and-benefits-list-item">3 layer termination process with nickel barrier prevents leaching & provides excellent solderability</li><li class="features-and-benefits-list-item">Suitable for all type of soldering processes</li><li class="features-and-benefits-list-item">Tight dimensional tolerances</li><li class="features-and-benefits-list-item">Maximum working voltage depends on case size</li><li class="features-and-benefits-list-item">Operating temperature of -55°C to +125°C(CR0201) and -55°C to +155; Supplier 1: Farnell; Manufacturer: BOURNS; Manufacturer Part Number: CR0603-J/-000ELF; RoHS: YES; Stock 1: 58200; Pricing 1: 10=0.0146, 250=0.0097, 1000=0.0073, 5000=0.0049, 12500=0.0042 (GBP); Resistance Tolerance: ± 5%; Packaging: Cut Tape; Resistor Element Material: Thick Film; Temperature Coefficient: -; Automotive Qualification Standard: -; MSL: MSL 1 - Unlimited; ComponentLink1URL: http://www.bourns.com/engineering/CHPREZTR/cr0603.stp; ComponentLink1Description: http://www.bourns.com/engineering/CHPREZTR/cr0603.stp; ComponentLink2URL: http://www.farnell.com/datasheets/2178762.pdf; ComponentLink2Description: http://www.farnell.com/datasheets/2178762.pdf; Supplier Part Number 1: 2008343
R?#2 = 470k: MULTICOMP - MCWR06X4703FTL - RES, THICK FILM, 470K, 1%, 0.1W, 0603; Resistance: 470; Voltage Rating: 50; Resistor Case Style: 0603 [1608 Metric]; Power Rating: 100; Product Range: MCWR Series; Temperature Coefficient: ± 100; SVHC: No SVHC (07-Jul-2017)<!--FANDB--><div class="features-and-benefits-container"><div class="features-and-benefits-desc-container"><span class="features-and-benefits-container-desc">SMD Chip Resistor, Thick Film, 470 kohm, 50 V, 0603 [1608 Metric], 100 mW, ± 1; Supplier 1: Farnell; Manufacturer: MULTICOMP; Manufacturer Part Number: MCWR06X4703FTL; RoHS: Y-EX; Stock 1: 30538; Pricing 1: 10=0.0035, 100=0.0021, 500=0.0015, 1000=0.0012, 2500=0.001 (GBP); Resistance Tolerance: ± 1%; Packaging: Cut Tape; Resistor Element Material: Thick Film; Automotive Qualification Standard: -; ComponentLink1URL: http://www.farnell.com/datasheets/1849611.pdf; ComponentLink1Description: http://www.farnell.com/datasheets/1849611.pdf; Supplier Part Number 1: 2447373
R?#3 = 100k: MULTICOMP - MCMR06X104 JTL - RES, CERAMIC, 100K, 5%, 0.1W, 0603; Resistance: 100; Voltage Rating: 75; Resistor Case Style: 0603 [1608 Metric]; Product Range: MCMR Series; Temperature Coefficient: ± 100; Resistor Mounting: Surface Mount Device<!--FANDB--><div class="features-and-benefits-container"><div class="features-and-benefits-description"><span class="features-benefits-value">The Multicomp MCMR series resistors are automotive grade, anti sulphured thick film chip resistor. The resistance range includes E24 and E96 decade values from 1ohm to 10Mohm. These resistors are constructed on top of a high grade ceramic body.</span></div><div class="features-and-benefits-list"><ul class="features-and-benefits-list-list"><li class="features-and-benefits-list-item">EIA 0402, 0603, 0805, 1206 chip sizes available</li><li class="features-and-benefits-list-item">High reliability and stability</li><li class="features-and-benefits-list-item">Automotive grade AEC-Q200 compliant</li><li class="features-and-benefits-list-item">Complaint with (IEC 60068-1) 55/155/56 climatic category</li><li class="features-and-benefits-list-item">Maximum operation voltage of 50V, 75V, 150V and 200V</li><li class="features-and-benefits-list-item">Power rating of 62.5mW, 100mW, 125mW and 250mW</li><li class="features-and-benefits-list-item">Available in ±1% and ±5% tolerance</li><li class="features-and-benefits-list-item">Temperature coefficient (TCR) of +200ppm/°C, +100ppm/°C and -200ppm/°C to +400ppm/°C</li><li class="features-and-benefits-list-item">Operating temperature range -55°C to 155; Supplier 1: Farnell; Manufacturer: MULTICOMP; Manufacturer Part Number: MCMR06X104 JTL; RoHS: Y-EX; Stock 1: 187; Pricing 1: 10=0.0109, 100=0.0085, 500=0.006, 1000=0.0048, 2500=0.004, 5000=0.003, 25000=0.002, 50000=0.0016 (GBP); Power Rating: 100; Resistance Tolerance: ± 5%; Packaging: Cut Tape; Resistor Element Material: Ceramic; Automotive Qualification Standard: -; ComponentLink1URL: http://www.farnell.com/datasheets/1716707.pdf; ComponentLink1Description: http://www.farnell.com/datasheets/1716707.pdf; Supplier Part Number 1: 2073357
R?#4 = 150k: MULTICOMP - MCWR06X1503FTL - RES, THICK FILM, 150KOHM, 1%, 0.1W; Resistance: 150; Voltage Rating: 50; Resistor Case Style: 0603 [1608 Metric]; Power Rating: 100; Product Range: MCWR Series; Temperature Coefficient: ± 100; SVHC: No SVHC (07-Jul-2017)<!--FANDB--><div class="features-and-benefits-container"><div class="features-and-benefits-desc-container"><span class="features-and-benefits-container-desc">SMD Chip Resistor, Thick Film, 150 kohm, 50 V, 0603 [1608 Metric], 100 mW, ± 1; Supplier 1: Farnell; Manufacturer: MULTICOMP; Manufacturer Part Number: MCWR06X1503FTL; RoHS: Y-EX; Stock 1: 11455; Pricing 1: 10=0.0033, 100=0.002, 500=0.0014, 1000=0.0011, 2500=0.0009 (GBP); Resistance Tolerance: ± 1%; Packaging: Cut Tape; Resistor Element Material: Thick Film; Automotive Qualification Standard: -; ComponentLink1URL: http://www.farnell.com/datasheets/1849611.pdf; ComponentLink1Description: http://www.farnell.com/datasheets/1849611.pdf; Supplier Part Number 1: 2447254
R?#5 = 10k: MULTICOMP - MCMR06X103 JTL - RES, CERAMIC, 10K, 5%, 0.1W, 0603; Resistance: 10; Voltage Rating: 75; Resistor Case Style: 0603 [1608 Metric]; Power Rating: 100; Product Range: MCMR Series; Temperature Coefficient: ± 100; Automotive Qualification Standard: -<!--FANDB--><div class="features-and-benefits-container"><div class="features-and-benefits-description"><span class="features-benefits-value">The Multicomp MCMR series resistors are automotive grade, anti sulphured thick film chip resistor. The resistance range includes E24 and E96 decade values from 1ohm to 10Mohm. These resistors are constructed on top of a high grade ceramic body.</span></div><div class="features-and-benefits-list"><ul class="features-and-benefits-list-list"><li class="features-and-benefits-list-item">EIA 0402, 0603, 0805, 1206 chip sizes available</li><li class="features-and-benefits-list-item">High reliability and stability</li><li class="features-and-benefits-list-item">Automotive grade AEC-Q200 compliant</li><li class="features-and-benefits-list-item">Complaint with (IEC 60068-1) 55/155/56 climatic category</li><li class="features-and-benefits-list-item">Maximum operation voltage of 50V, 75V, 150V and 200V</li><li class="features-and-benefits-list-item">Power rating of 62.5mW, 100mW, 125mW and 250mW</li><li class="features-and-benefits-list-item">Available in ±1% and ±5% tolerance</li><li class="features-and-benefits-list-item">Temperature coefficient (TCR) of +200ppm/°C, +100ppm/°C and -200ppm/°C to +400ppm/°C</li><li class="features-and-benefits-list-item">Operating temperature range -55°C to 155; Supplier 1: Farnell; Manufacturer: MULTICOMP; Manufacturer Part Number: MCMR06X103 JTL; RoHS: Y-EX; Stock 1: 19791; Pricing 1: 10=0.0087, 100=0.0074, 500=0.0061, 1000=0.0048, 2500=0.0032, 5000=0.0024, 25000=0.0016, 50000=0.0013 (GBP); Resistance Tolerance: ± 5%; Packaging: Cut Tape; Resistor Element Material: Ceramic; ComponentLink1URL: http://www.farnell.com/datasheets/1716707.pdf; ComponentLink1Description: http://www.farnell.com/datasheets/1716707.pdf; Supplier Part Number 1: 2073356
R?#6 = 12k: MULTICOMP - MC0063W0603112K - RES, THICK FILM, 12K, 1%, 0.063W, 0603; Resistance: 12; Voltage Rating: 50; Resistor Case Style: 0603 [1608 Metric]; Power Rating: 63; Product Range: MC Series; Temperature Coefficient: ± 100; Reel Quantity: 5000; Resistor Mounting: Surface Mount Device<!--FANDB--><div class="features-and-benefits-container"><div class="features-and-benefits-description"><span class="features-benefits-value">The Multicomp MC series current sense resistors are thick film chip resistors. The resistance range includes E96 and E24 decade values from 1ohm to 10Mohm.</span></div><div class="features-and-benefits-list"><ul class="features-and-benefits-list-list"><li class="features-and-benefits-list-item">EIA 0402, 0603, 0805, 1206 chip sizes available</li><li class="features-and-benefits-list-item">Small size and low weight</li><li class="features-and-benefits-list-item">Suitable for both wave and reflow soldering</li><li class="features-and-benefits-list-item">Reduction of assembly costs</li><li class="features-and-benefits-list-item">Maximum working voltage of 50V(0402, 0603), 150V(0805), 200V(1206)</li><li class="features-and-benefits-list-item">Available in ±1%, ±2% and ±5% tolerance</li><li class="features-and-benefits-list-item">Power rating of 62.5mW, 100mW and 125mW</li><li class="features-and-benefits-list-item">±400ppm/°C(1ohm to 10ohm), ±200ppm/°C(11ohm to 100ohm), ±100; Manufacturer: MULTICOMP; Manufacturer Part Number: MC0063W0603112K; RoHS: Y-EX; Resistance Tolerance: ± 1%; Packaging: Tape & Reel; Resistor Element Material: Thick Film; Automotive Qualification Standard: -; ComponentLink1URL: http://www.farnell.com/datasheets/1788326.pdf; ComponentLink1Description: http://www.farnell.com/datasheets/1788326.pdf; ComponentLink2URL: http://www.farnell.com/datasheets/1944283.pdf; ComponentLink2Description: http://www.farnell.com/datasheets/1944283.pdf; Supplier 1: Farnell; Supplier Part Number 1: 9330518
SCAP?#1 SCAP?#2 = 50F/2.7V: CAPACITOR 50F -10% +30% 2.7V TH; Manufacturer: CDE Illinois Capacitor; Manufacturer Part Number: DGH506Q2R7; Supplier 1: Digi-Key; Stock 1: 497; Pricing 1: 1=4.22, 10=3.4, 100=2.652, 500=1.972, 1000=1.836, 2500=1.768, 5000=1.734 (USD); Supplier Part Number 1: 1572-1770-ND
T4 = T_M - DMG2302UK: MOSFET Transistor, N Channel, 2.8 A, 20 V, 0.061 ohm, 4.5 V, 600 mV; ELRAD Id sifra / ELRAD Id No: 597778; Opis / Description: MOSFET BSS123       /N-Channel; Komp / Device: SMD; Value: BSS123; Velikost / Size: SOT23; FIT: 0.44; Manufacturer Part Number: DMG2302UK-7; Author: Ciril Golob; ComponentLink1Description: Datasheet; ComponentLink1URL: http://www.farnell.com/datasheets/2814387.pdf?_ga=2.180867175.1196948029.1566195061-1373726713.1554121096&_gac=1.87830250.1562763802.CjwKCAjwmZbpBRAGEiwADrmVXm8xT8OHDZvJe8qZIQyyGmIuiUD-TEITatw0hIdDkyBwIXXCH7oneRoCl7cQAvD_BwE; Date: 11.07.2018; ComponentLINK1Description: Datasheet; ComponentLINK2Description: Datasheet www; ComponentLINK1URL: c:\ELRADSVN\Altium_Library\Libraries\Active\Datasheet\BSS123.pdf; ComponentLINK2URL: http://www.onsemi.com/pub/Collateral/BSS123-D.PDF; Supplier 1: Farnell; Supplier Part Number 1: 3127315